# EAGLE design FRA_breakout6U_v1 (EAGLE 9.6.2)
CNAME: FRA Junction Board; CREVISION: 02
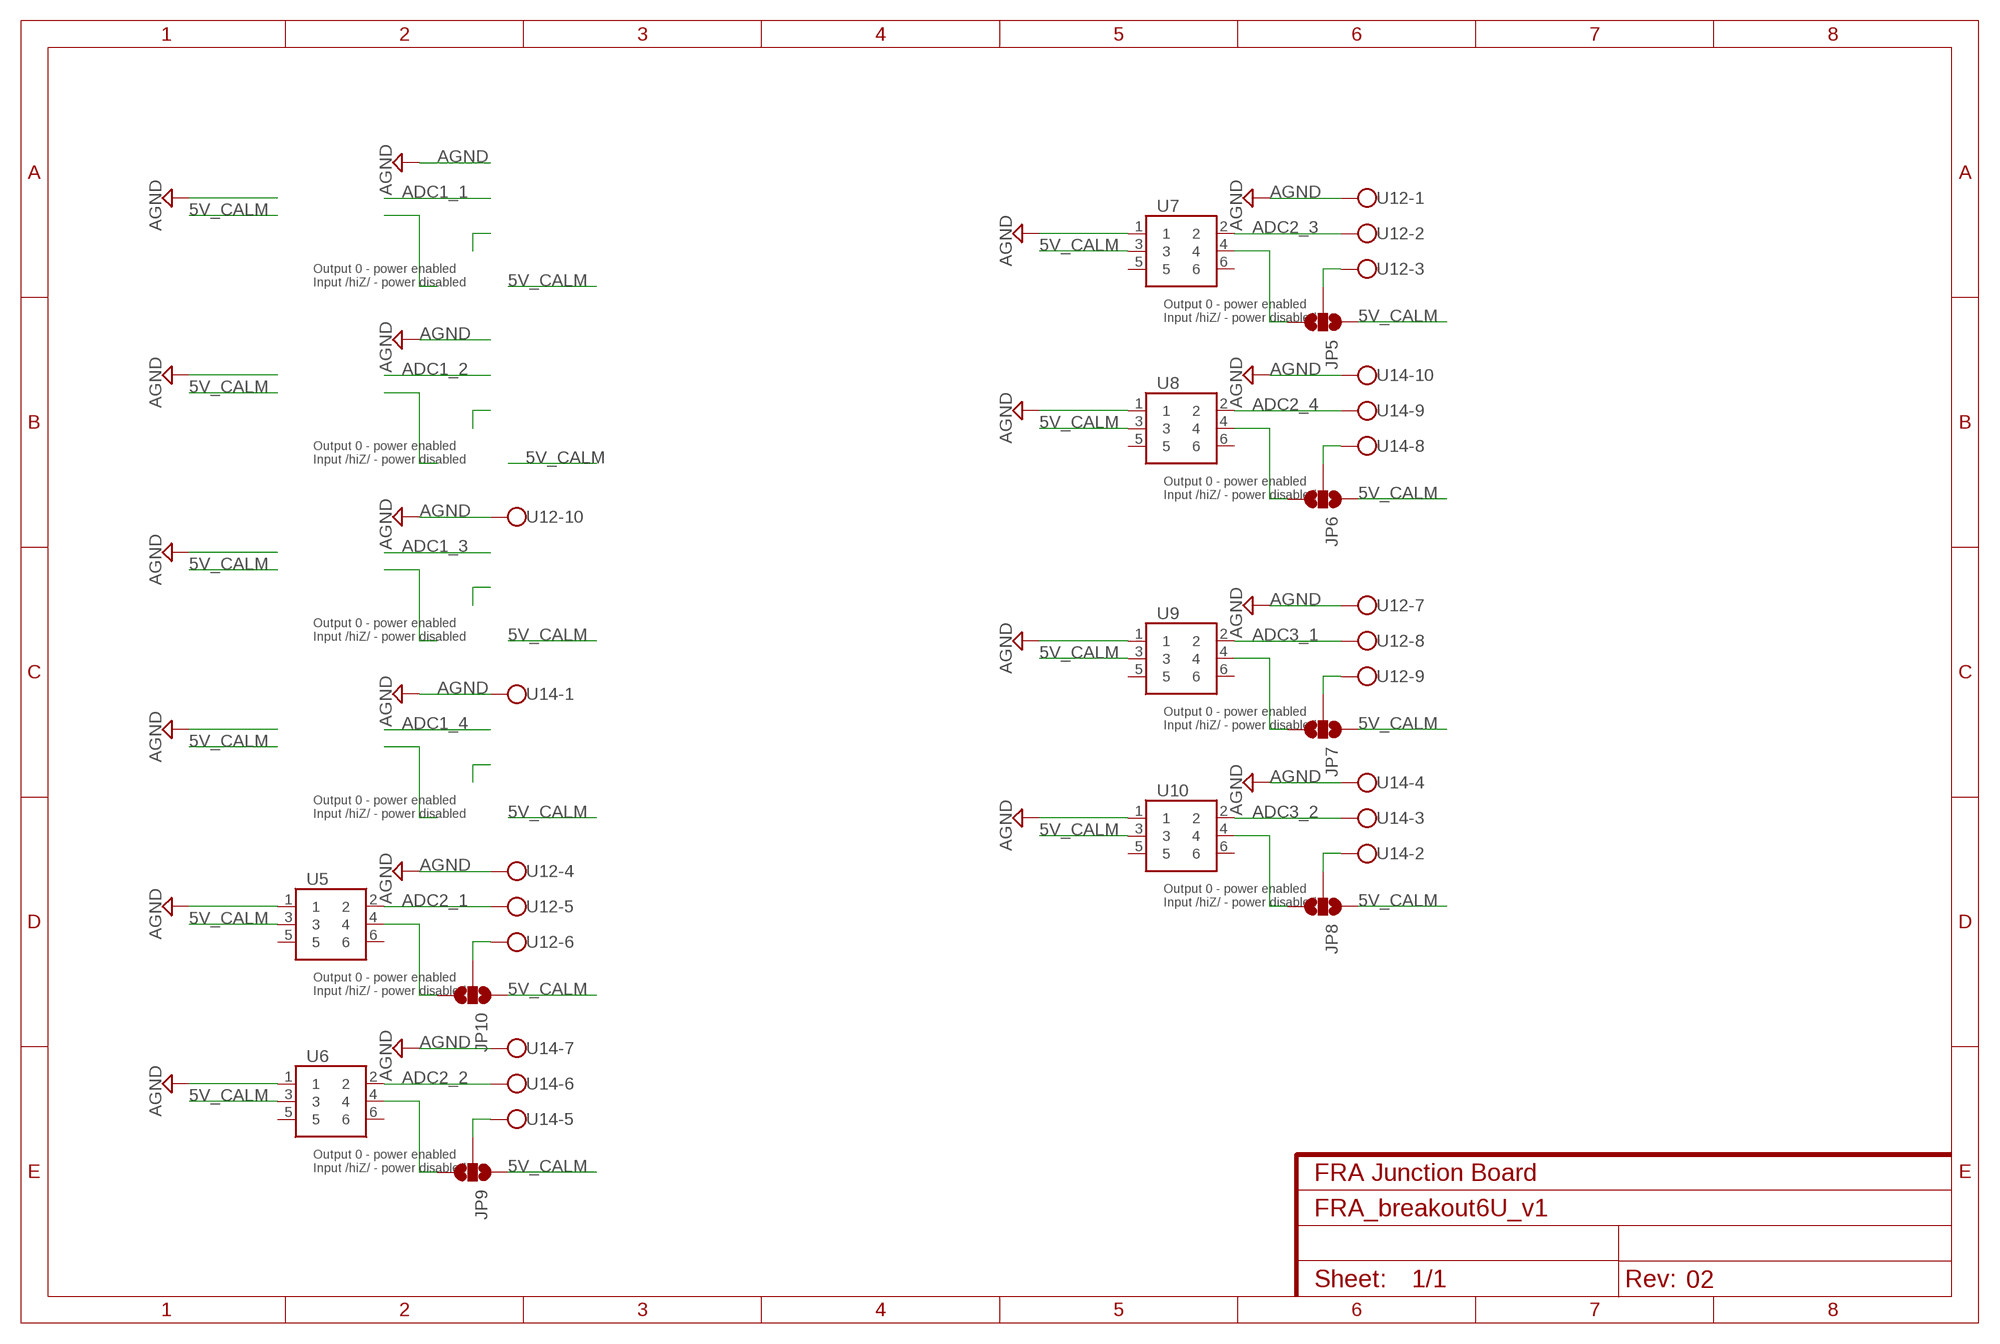
[diagram p0: schematic, sheet 1]

## Parts
JP5  JUMPER-SMT_3_NO_NO_SILK  [SMT-JUMPER_3_0-NO_TRACE_NO-SILK]
JP6  JUMPER-SMT_3_NO_NO_SILK  [SMT-JUMPER_3_0-NO_TRACE_NO-SILK]
JP7  JUMPER-SMT_3_NO_NO_SILK  [SMT-JUMPER_3_0-NO_TRACE_NO-SILK]
JP8  JUMPER-SMT_3_NO_NO_SILK  [SMT-JUMPER_3_0-NO_TRACE_NO-SILK]
JP9  JUMPER-SMT_3_NO_NO_SILK  [SMT-JUMPER_3_0-NO_TRACE_NO-SILK]
JP10  JUMPER-SMT_3_NO_NO_SILK  [SMT-JUMPER_3_0-NO_TRACE_NO-SILK]
U5  SSW-103-01-F-D  [SHDR6W79P254_2X3_813X495X851P]
U6  SSW-103-01-F-D  [SHDR6W79P254_2X3_813X495X851P]
U7  SSW-103-01-F-D  [SHDR6W79P254_2X3_813X495X851P]
U8  SSW-103-01-F-D  [SHDR6W79P254_2X3_813X495X851P]
U9  SSW-103-01-F-D  [SHDR6W79P254_2X3_813X495X851P]
U10  SSW-103-01-F-D  [SHDR6W79P254_2X3_813X495X851P]
U12  TB003V-500-P10BE  [TB003V-500-P10BE]
U14  TB003V-500-P10BE  [TB003V-500-P10BE]

## Nets
5V_CALM: JP5.1 JP6.1 JP7.1 JP8.1 JP9.1 JP10.1 U5.3 U6.3 U7.3 U8.3 U9.3 U10.3
ADC2_1: U5.2 U12.5
ADC2_2: U6.2 U14.6
ADC2_3: U7.2 U12.2
ADC2_4: U8.2 U14.9
ADC3_1: U9.2 U12.8
ADC3_2: U10.2 U14.3
AGND: U5.1 U6.1 U7.1 U8.1 U9.1 U10.1 U12.1 U12.4 U12.7 U12.10 U14.1 U14.4 U14.7 U14.10
N$7: JP5.2 U12.3
N$8: JP5.3 U7.4
N$9: JP6.2 U14.8
N$10: JP6.3 U8.4
N$11: JP7.2 U12.9
N$12: JP7.3 U9.4
N$13: JP8.2 U14.2
N$14: JP8.3 U10.4
N$15: JP9.2 U14.5
N$16: JP9.3 U6.4
N$17: JP10.2 U12.6
N$18: JP10.3 U5.4
Unconnected: U5.5 U5.6 U6.5 U6.6 U7.5 U7.6 U8.5 U8.6 U9.5 U9.6 U10.5 U10.6

## Notes on the sheet
- Output 0 - power enabled
  Input /hiZ/ - power disabled
- Output 0 - power enabled
  Input /hiZ/ - power disabled
- Output 0 - power enabled
  Input /hiZ/ - power disabled
- Output 0 - power enabled
  Input /hiZ/ - power disabled
- Output 0 - power enabled
  Input /hiZ/ - power disabled
- Output 0 - power enabled
  Input /hiZ/ - power disabled
- Output 0 - power enabled
  Input /hiZ/ - power disabled
- Output 0 - power enabled
  Input /hiZ/ - power disabled
- Output 0 - power enabled
  Input /hiZ/ - power disabled
- Output 0 - power enabled
  Input /hiZ/ - power disabled

## Library data of the parts
JP5-JP10 = SparkFun-Jumpers:JUMPER-SMT_3_NO: Normally open jumper This jumper has three pads in close proximity to each other. Apply solder to close the connection(s).
U5-U10 = SamacSys_Parts:SSW-103-01-F-D: .100" Tiger Buy Socket Strip, 03 positions per row, D row Source: Datasheet <https://componentsearchengine.com/Datasheets/1/SSW-103-01-F-D.pdf>; DESCRIPTION: .100" Tiger Buy Socket Strip, 03 positions per row, D row; HEIGHT: 8.51mm; MANUFACTURER_NAME: SAMTEC; MANUFACTURER_PART_NUMBER: SSW-103-01-F-D; MOUSER_PART_NUMBER: 200-SSW10301FD; MOUSER_PRICE-STOCK: https://www.mouser.com/Search/Refine.aspx?Keyword=200-SSW10301FD; PARTNO: 61200621621
U12 U14 = SamacSys_Parts:TB003V-500-P10BE

## Board
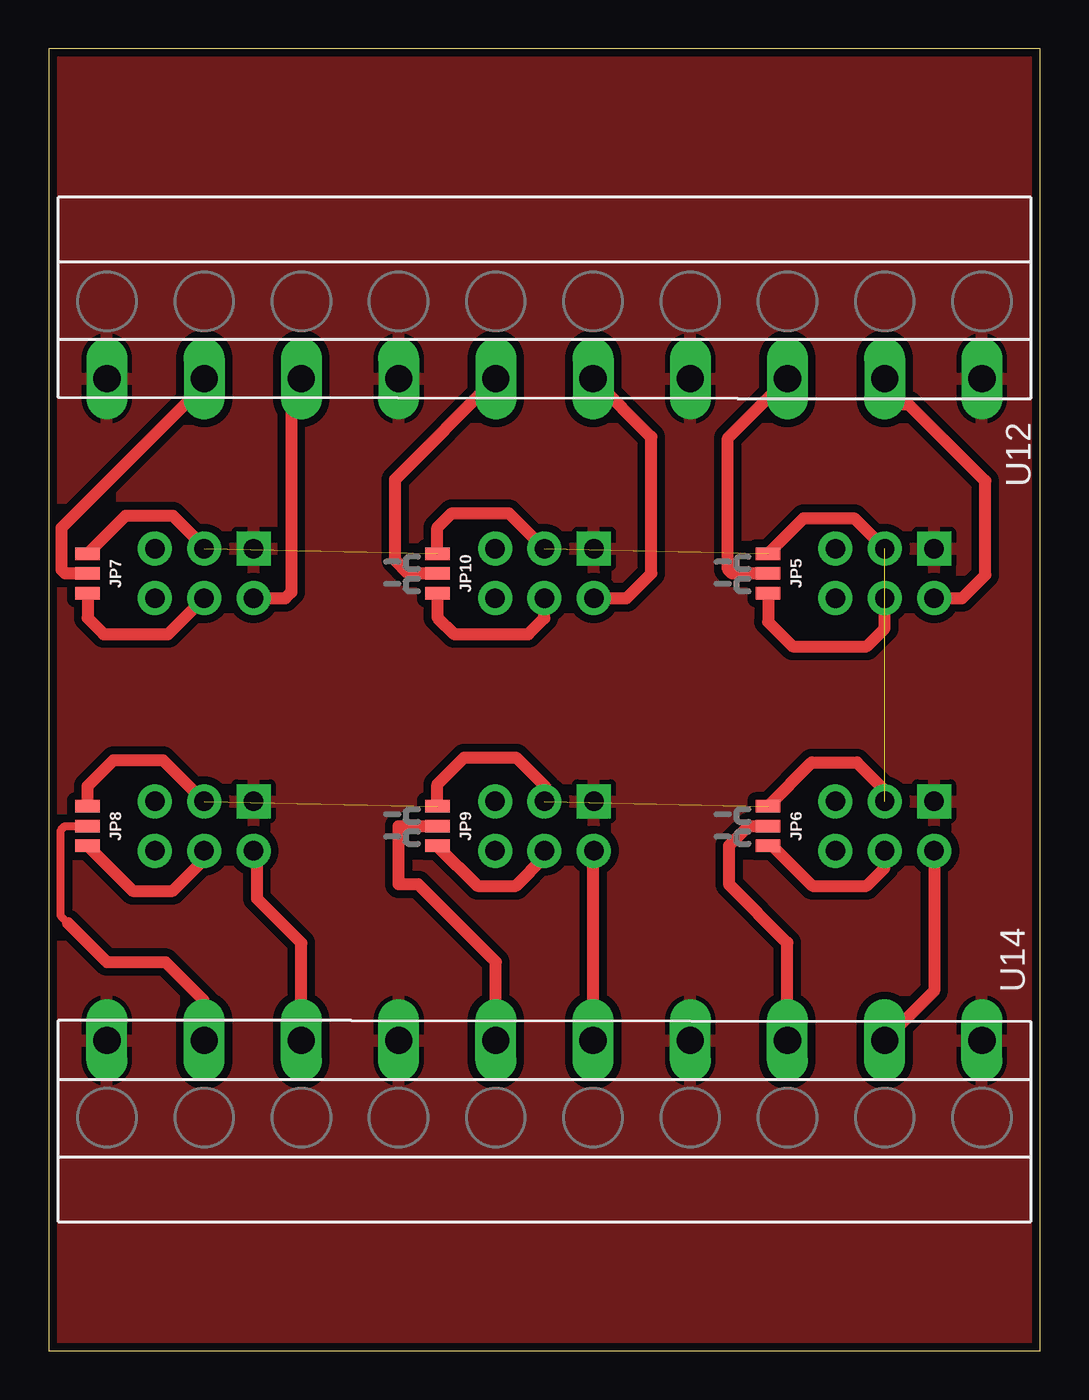
[diagram p1: board, top side]
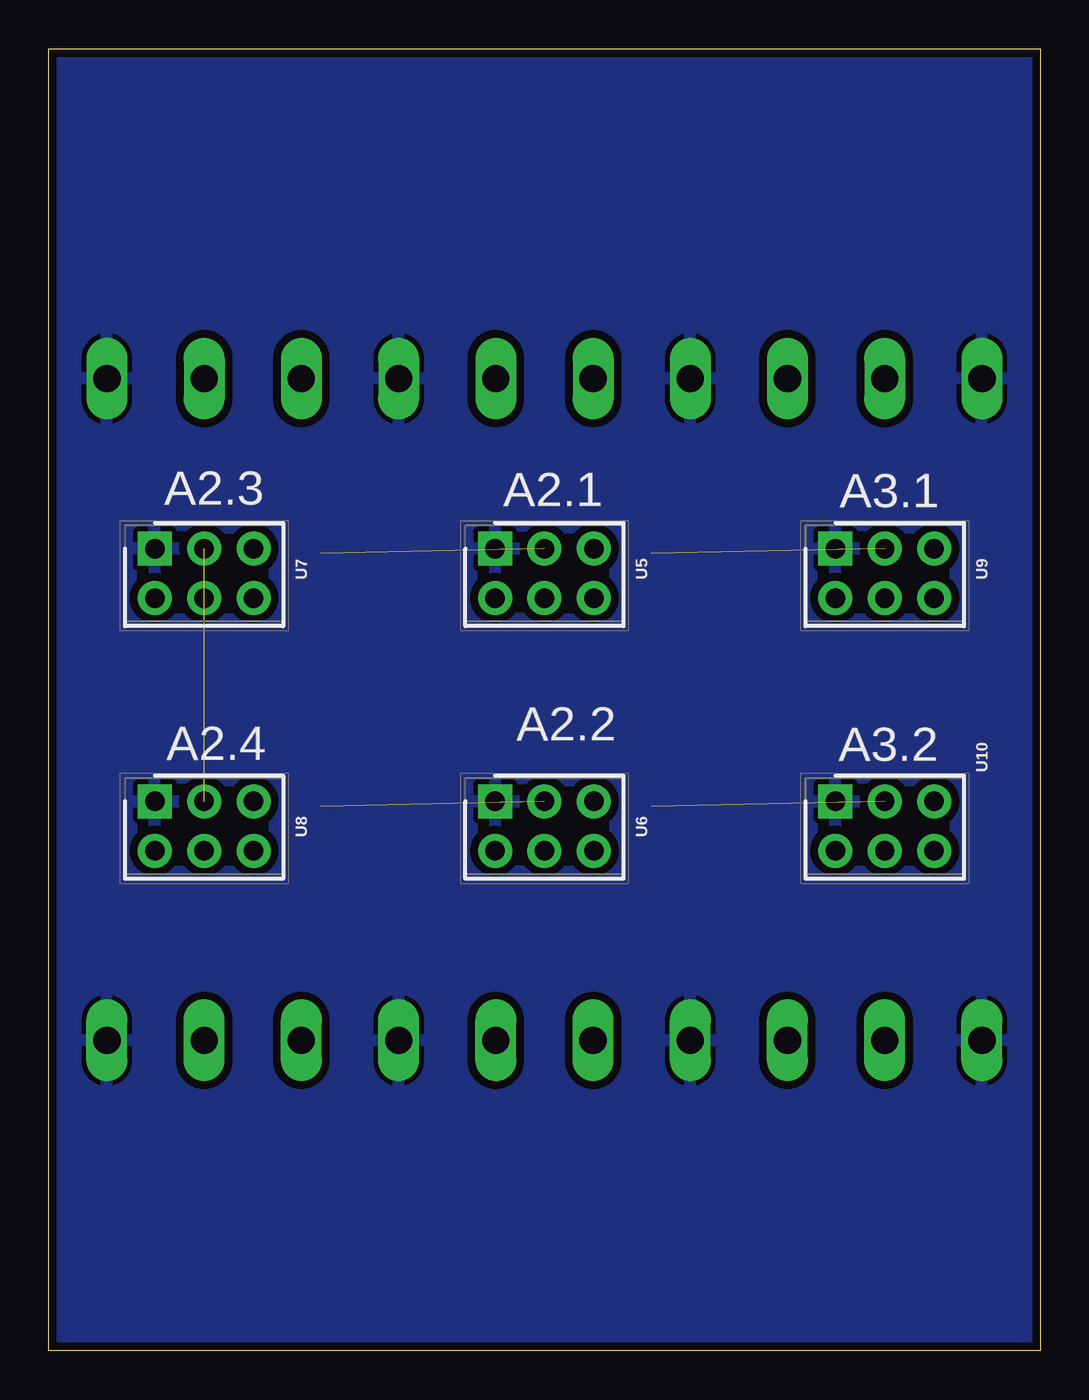
[diagram p2: board, bottom side, seen from below]

Size 51 x 67 mm. Coordinates in mm from the lower left corner, seen from the top.
Outline: 0,0 51,0 51,67 0,67 0,0
Copper layers (1*16): Top 0.035mm / dielectric 1.6mm / Bottom 0.035mm
Design rules "AllPCB": minimum track width 6mil, minimum drill 0.399mm, track to track 0.149859375mm, track to pad 0.149859375mm, pad to pad 8mil, via to via 17mil, smd to smd 6mil, copper to edge 10mil, drill to drill 24mil, minimum pad ring 10mil, minimum via ring 8mil, stop-mask expansion 4mil, vias tented up to drill 0.3mm, thermal gap 10mil

### Footprints (pad centres in the part's own frame; a part is rotated, then mirrored left to right if it is on the bottom)
SMT-JUMPER_3_0-NO_TRACE_NO-SILK = smd 0.635 x 1.27: 1 -1.016,0; 2 0,0; 3 1.016,0
SHDR6W79P254_2X3_813X495X851P = drill 1 pad 1.75 square: 1 -1.27,-2.54 | drill 1 pad 1.75: 2 1.27,-2.54; 3 -1.27,0; 4 1.27,0; 5 -1.27,2.54; 6 1.27,2.54
TB003V-500-P10BE = drill 1.4 long: 1 0,-0.02; 2 5,-0.02; 3 10,-0.02; 4 15,-0.02; 5 20,-0.02; 6 25,-0.02; 7 30,-0.02; 8 35,-0.02; 9 40,-0.02; 10 45,-0.02

### Placement (x,y rotation side)
JP5  37,40 270 top
JP6  37,27 270 top
JP7  2,40 270 top
JP8  2,27 270 top
JP9  20,27 270 top
JP10  20,40 270 top
U5  25.5,40 270 bottom
U6  25.5,27 270 bottom
U7  43,40 270 bottom
U8  43,27 270 bottom
U9  8,40 270 bottom
U10  8,27 270 bottom
U12  48,50 180 top
U14  3,16 0 top

### Tracks (layer width: path | path; a pad name or v marks a point on that pad's centre or on a via)
5V_CALM  (5 unrouted)
  Top 0.61: JP7.1 3.96,42.97 6.39,42.97 8,41.36 U9.3 | JP10.1 20,42.36 20.74,43.1 23.67,43.1 U5.3 | JP5.1 38.83,42.85 41.42,42.85 U7.3 | JP8.1 2,29.06 3.34,30.4 5.87,30.4 U10.3 | JP9.1 20,29.15 21.37,30.53 24.04,30.53 25.56,29 25.56,28.33 U6.3 | JP6.1 39.26,30.27 41.57,30.27 43,28.84 U8.3
ADC2_1
  Top 0.61: U5.2 29.73,38.73 31,40 31,47.02 U12.5
ADC2_2
  Top 0.61: U14.6 28,25.22 28.04,25.26 U6.2
ADC2_3
  Top 0.61: U7.2 46.98,38.73 48.17,39.92 48.17,44.75 44.23,48.69 43,48.69 U12.2
ADC2_4
  Top 0.61: 45.63,25.64 U8.2 45.54,18.52 U14.9
ADC3_1
  Top 0.61: U9.2 12.18,38.73 12.48,39.04 12.48,49.5 U12.8
ADC3_2
  Top 0.61: U14.3 13,20.98 10.71,23.27 10.71,25.57 U10.2
AGND
  pour Top (isolate 0.406): -12.95,68.07 102.49,68.07 110.74,59.82 110.74,-3.05 109.86,-3.94 -3.68,-3.94 -3.81,-4.06 -3.81,58.93
  pour Bottom (isolate 0.406): 3.16,70.98 92.85,70.98 105.92,57.91 105.92,-2.29 102.36,-5.84 -1.02,-5.84 -6.22,-0.64 -6.22,61.59
N$7
  Top 0.61: JP5.2 35.14,40 34.93,40.21 34.93,46.95 U12.3
N$8
  Top 0.61: JP5.3 37,37.52 36.99,37.51 38.26,36.24 42.07,36.24 43,37.17 U7.4
N$9
  Top 0.61: U14.8 38,21 35,24 35,26 36,27 JP6.2
N$10
  Top 0.61: JP6.3 37.22,25.98 39.28,23.92 42.07,23.92 43,24.85 U8.4
N$11
  Top 0.61: JP7.2 0.85,40 0.67,40.18 0.67,42.35 8,49.68 U12.9
N$12
  Top 0.61: JP7.3 2,37.71 2.83,36.88 6.15,36.88 U9.4
N$13
  Top 0.406: 1,22 0.64,22.36 0.64,26.8 0.84,27 JP8.2
  Top 0.61: 1.98,27 JP8.2 | 1,22 3,20 6,20 8,18 U14.2
N$14
  Top 0.61: JP8.3 4.32,23.67 6.39,23.67 8,25.28 U10.4
N$15
  Top 0.61: U14.5 23,20 19,24 18,24 18,27 JP9.2
N$16
  Top 0.61: JP9.3 22.06,23.92 24.04,23.92 25.5,25.38 U6.4
N$17
  Top 0.61: JP10.2 18.5,40 17.82,40.69 17.82,44.84 U12.6
N$18
  Top 0.61: JP10.3 20,37.74 20.86,36.88 24.68,36.88 25.5,37.7 U5.4

### Text on the board
bNames: A2.3 | A3.1 | A2.1 | A2.2 | A3.2 | A2.4
tDocu: --- / GND / --- / 5V / --- / A3.1 / --- / GND / --- / 5V / --- / A2.2 / --- / GND / --- / 5V / --- / A2.1 / --- / GND | 100mA / / 2A | 100mA / / 2A | Breakout 6U | Electronics design solutions s.r.o. | J. Repcik 12/2020 | 100mA / / 2A | 100mA / / 2A | --- / GND / --- / 5V / --- / A3.2 / --- / GND / --- / 5V / --- / A2.3 / --- / GND / --- / 5V / --- / A2.0 / --- / GND
bDocu: 5V | SDA_5V | GND | SCL_5V | AnalogIN | 5V/HiZ